# EAGLE design slo rev0.1 (EAGLE 9.1.1)
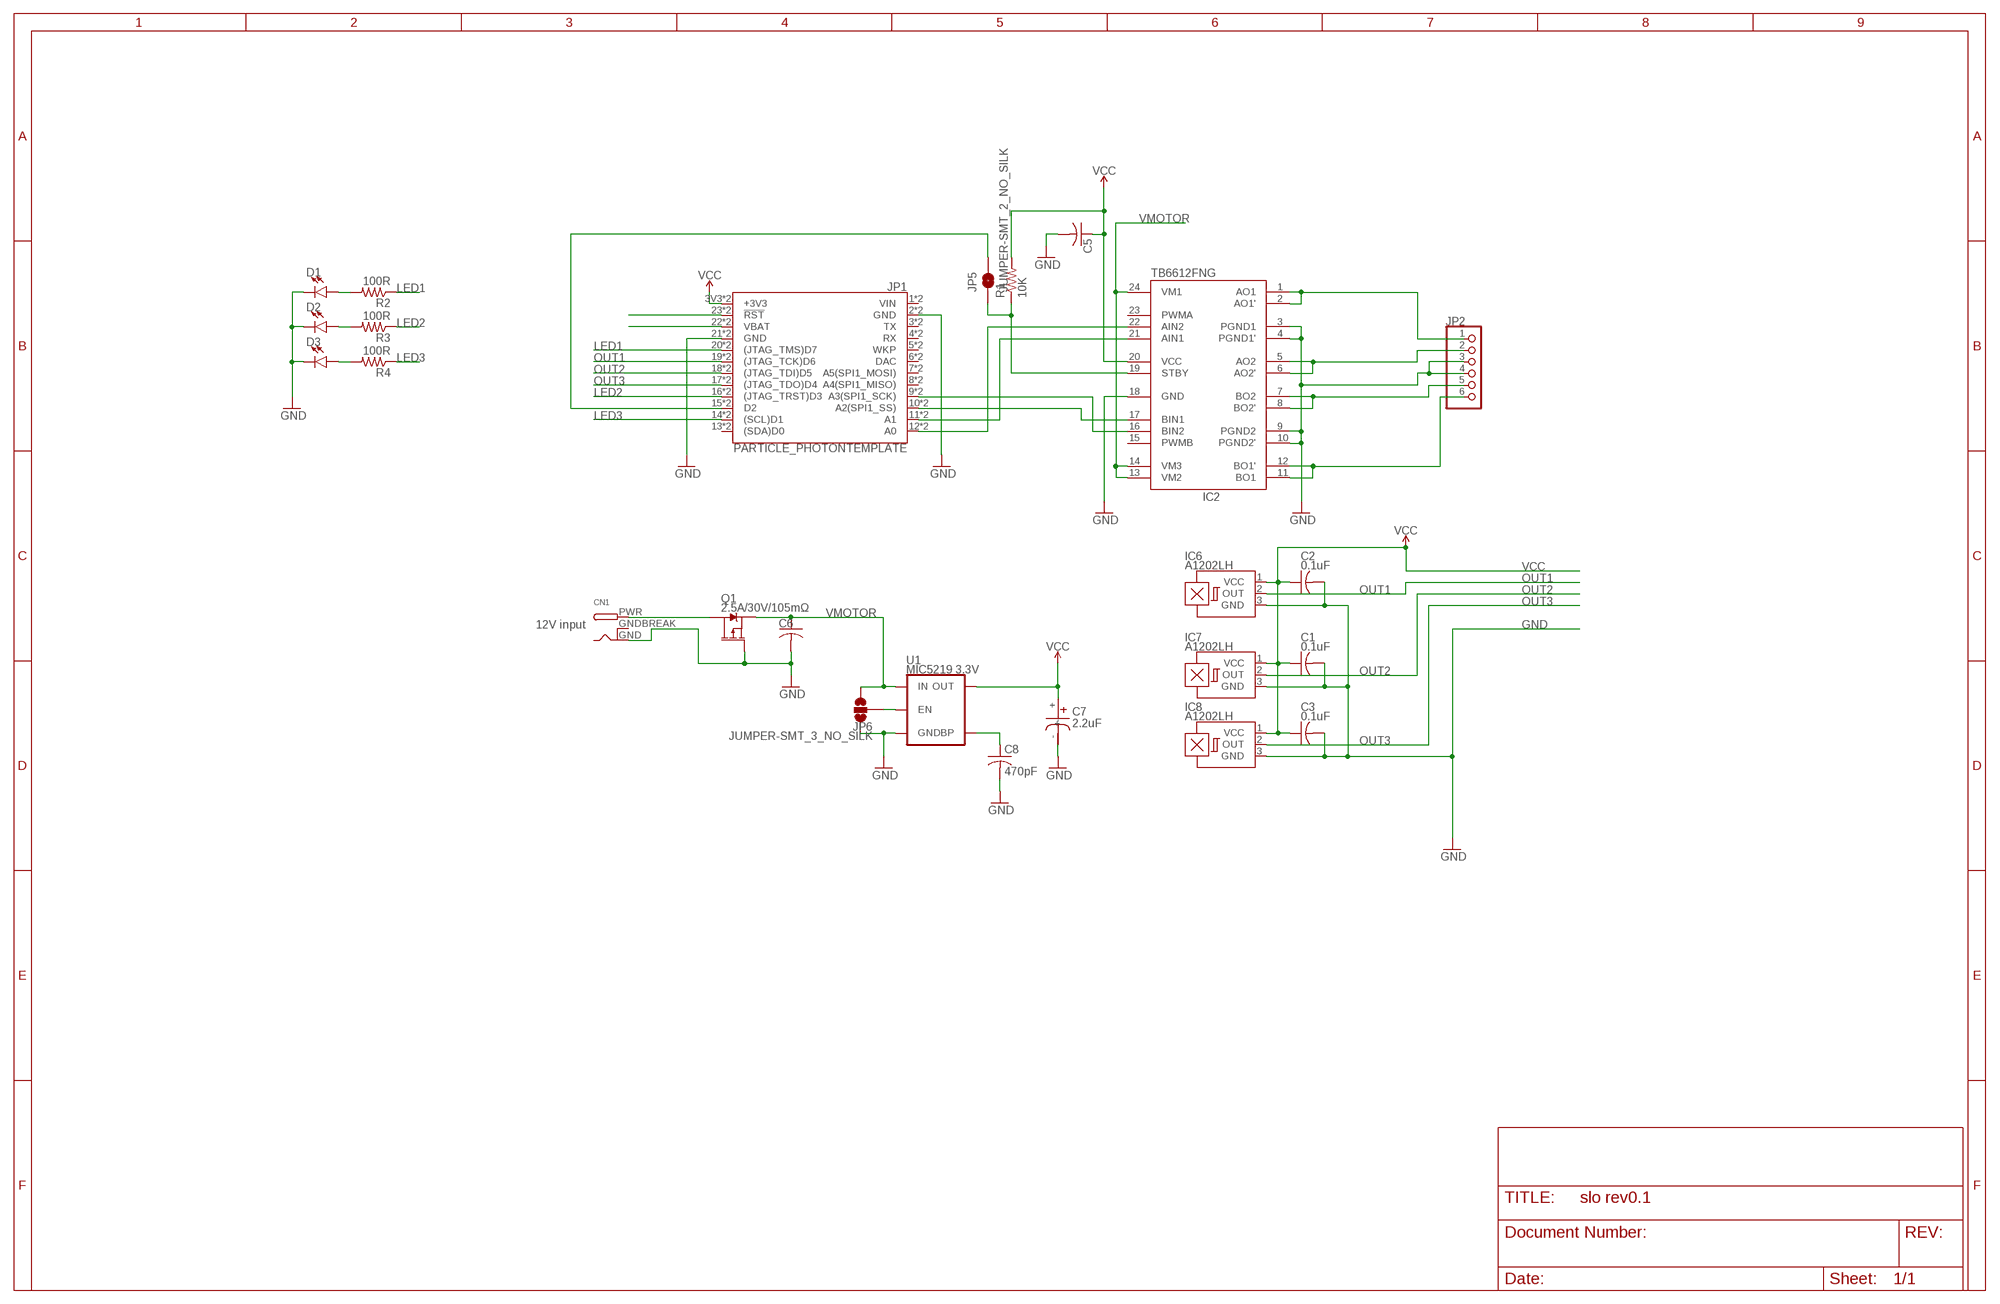
[diagram p0: schematic, sheet 1]

## Parts
C1  0.1uF  C-USC0603  [C0603]
C2  0.1uF  C-USC0603  [C0603]
C3  0.1uF  C-USC0603  [C0603]
C5  C-USC1206  [C1206]
C6  C-USC1206  [C1206]
C7  2.2uF  0603_TANTALUM_CAP  [0603_TANTALUM_CAPACITOR]
C8  470pF  C-USC0603  [C0603]
CN1  DCBARRELPTH  [DCJACK_2MM_PTH]
D1  LED-FKIT-1206  [FKIT-LED-1206]
D2  LED-FKIT-1206  [FKIT-LED-1206]
D3  LED-FKIT-1206  [FKIT-LED-1206]
IC2  TB6612FNG  [SSOP24]
IC6  A1202LH  [SOT23-W]
IC7  A1202LH  [SOT23-W]
IC8  A1202LH  [SOT23-W]
JP1  PARTICLE_PHOTONTEMPLATE  [PARTICLE_PHOTON_TEMPLATE]
JP2  PINHD-1X6-3.5MM  [1X06-3.5MM]
JP5  JUMPER-SMT_2_NO_SILK  [SMT-JUMPER_2_NO_SILK]
JP6  JUMPER-SMT_3_NO_SILK  [SMT-JUMPER_3_NO_SILK]
Q1  2.5A/30V/105mΩ  MOSFET_PCH-DMG2307L  [SOT23-3]
R1  10K  R-US_R1206  [R1206]
R2  100R  R-US_R1206  [R1206]
R3  100R  R-US_R1206  [R1206]
R4  100R  R-US_R1206  [R1206]
U1  MIC5219 3.3V  V_REG_MIC52193.3V  [SOT23-5]

## Nets
GND: C1.2 C2.2 C3.2 C5.2 C6.2 C7.- C8.2 CN1.GND D1.C D2.C D3.C IC2.3(PGND1) IC2.4(PGND1') IC2.9(PGND2) IC2.10(PGND2') IC2.18(GND) IC6.3(GND) IC7.3(GND) IC8.3(GND) JP1.2(GND) JP1.21(GND) JP1.GND@0(GND) JP1.GND@2(GND) JP2.3 JP2.4 JP6.1 Q1.1(G) U1.2(GND)
LED1: JP1.20((JTAG_TMS)D7) JP1.D7((JTAG_TMS)D7) R2.1
LED2: JP1.16((JTAG_TRST)D3) JP1.D3((JTAG_TRST)D3) R3.1
LED3: JP1.14((SCL)D1) JP1.D1((SCL)D1) R4.1
N$1: IC2.1(AO1) IC2.2(AO1') JP2.1
N$2: IC2.5(AO2) IC2.6(AO2') JP2.2
N$3: IC2.7(BO2) IC2.8(BO2') JP2.5
N$4: IC2.11(BO1) IC2.12(BO1') JP2.6
N$5: CN1.PWR Q1.3(D)
N$6: IC2.19(STBY) JP5.1 R1.1
N$7: D1.A R2.2
N$8: JP1.22(VBAT) JP1.VBAT
N$9: JP6.2 U1.3(EN)
N$10: JP1.23(!RST!) JP1.RST(!RST!)
N$11: IC2.22(AIN2) JP1.12(A0) JP1.A0
N$12: IC2.21(AIN1) JP1.11(A1) JP1.A1
N$13: IC2.17(BIN1) JP1.10(A2(SPI1_SS)) JP1.A2(A2(SPI1_SS))
N$14: IC2.16(BIN2) JP1.9(A3(SPI1_SCK)) JP1.A3(A3(SPI1_SCK))
N$15: JP1.15(D2) JP1.D2 JP5.2
N$16: D2.A R3.2
N$17: C8.1 U1.4(BP)
N$18: D3.A R4.2
OUT1: IC6.2(OUT) JP1.19((JTAG_TCK)D6) JP1.D6((JTAG_TCK)D6)
OUT2: IC7.2(OUT) JP1.18((JTAG_TDI)D5) JP1.D5((JTAG_TDI)D5)
OUT3: IC8.2(OUT) JP1.17((JTAG_TDO)D4) JP1.D4((JTAG_TDO)D4)
VCC: C1.1 C2.1 C3.1 C5.1 C7.+ IC2.20(VCC) IC6.1(VCC) IC7.1(VCC) IC8.1(VCC) JP1.3V3(+3V3) JP1.24(+3V3) R1.2 U1.5(OUT)
VMOTOR: C6.1 IC2.13(VM2) IC2.14(VM3) IC2.24(VM1) JP6.3 Q1.2(S) U1.1(IN)
Unconnected: IC2.15(PWMB) IC2.23(PWMA) JP1.3(TX) JP1.4(RX) JP1.5(WKP) JP1.6(DAC) JP1.7(A5(SPI1_MOSI)) JP1.8(A4(SPI1_MISO)) JP1.13((SDA)D0) JP1.A4(A4(SPI1_MISO)) JP1.A5(A5(SPI1_MOSI)) JP1.D0((SDA)D0) JP1.DAC JP1.RX JP1.TX JP1.WKP

## Notes on the sheet
- 12V input

## Power pins joined to a net without a drawn wire
GNDBREAK: CN1.GNDBREAK
VIN: JP1.1(VIN) JP1.VIN

## Library data of the parts
C1-C3 C5 C6 C8 = resistor:C-US: CAPACITOR, American symbol
C7 = clackboard_lib:0603_TANTALUM_CAP: https://www.digikey.com/product-detail/en/avx-corporation/TACL475K006XTA/478-7522-1-ND/3660369 0603 Tantalum capacitor CAP TANT 4.7UF 6.3V 10% 0603 // digikey pn 478-7522-1-ND
CN1 = adafruit:DCBARREL: 2.0mm DC Barrel Jack DCJACK_2MM_PTH - Through Hole Jack (4UConnector: 05537)
D1-D3 = SparkFun-LED:LED: LED (Generic) Standard schematic elements and footprints for 5mm, 3mm, 1206, and 0603 sized LEDs. Generic LEDs with no color specified.
IC2 = adafruit:TB6612FNG: TB6612FNG MOS dual H-bridge motor driver, 1.2A current 3.2A peak 3 or 5v logic and 3-15v motor
IC6-IC8 = allegro:A12*?: Hall-effect bipolar switch Source: http://www.allegromicro.com/en/Products/Part_Numbers/1202/1202.pdf; OC_FARNELL: unknown; OC_NEWARK: unknown
JP1 = SparkFun-Boards:PARTICLE_PHOTON: Particle Photon Footprint of the Particle Photon that is used as a basis for many Photon shields. SparkFun Products: Particle Photon <https://www.sparkfun.com/products/13764> SparkFun Photon ProtoShield <https://www.sparkfun.com/products/13598> SparkFun Photon micro OLED Shield <https://www.sparkfun.com/products/13628> SparkFun Photon IMU Shield <https://www.sparkfun.com/products/13629> SparkFun Photon Battery Shield <https://www.sparkfun.com/products/13626>
JP2 = adafruit:PINHD-1X6: PIN HEADER
JP5 = SparkFun-Jumpers:JUMPER-SMT_2_NO: Normally open jumper This jumper has two pads in close proximity to each other. Apply solder to close the connection. Round pads are easier to solder for beginners, but are a lot larger. SparkFun Product that uses the round pads: SparkFun EL Sequencer <https://www.sparkfun.com/products/12781>
JP6 = SparkFun-Jumpers:JUMPER-SMT_3_NO: Normally open jumper This jumper has three pads in close proximity to each other. Apply solder to close the connection(s).
Q1 = SparkFun-DiscreteSemi:MOSFET_PCH: P-channel MOSFETs Voltage controlled devices that allow control of high current outputs. SparkFun Products: SparkFun ESP32 Thing <https://www.sparkfun.com/products/13907> SparkFun ESP8266 Thing <https://www.sparkfun.com/products/13231>; PROD_ID: TRANS-11308
R1-R4 = resistor:R-US_: RESISTOR, American symbol
U1 = SparkFun-IC-Power:V_REG_MIC5219: V_REG MIC5219 Standard 3.3V and 5V 500mA LDO voltage regulator in SOT-23 layout. Micrel part MIC5219. BP (by-pass) pin is used to lower output noise with 470pF cap, may be left open.; PROD_ID: VREG-09872

## Board
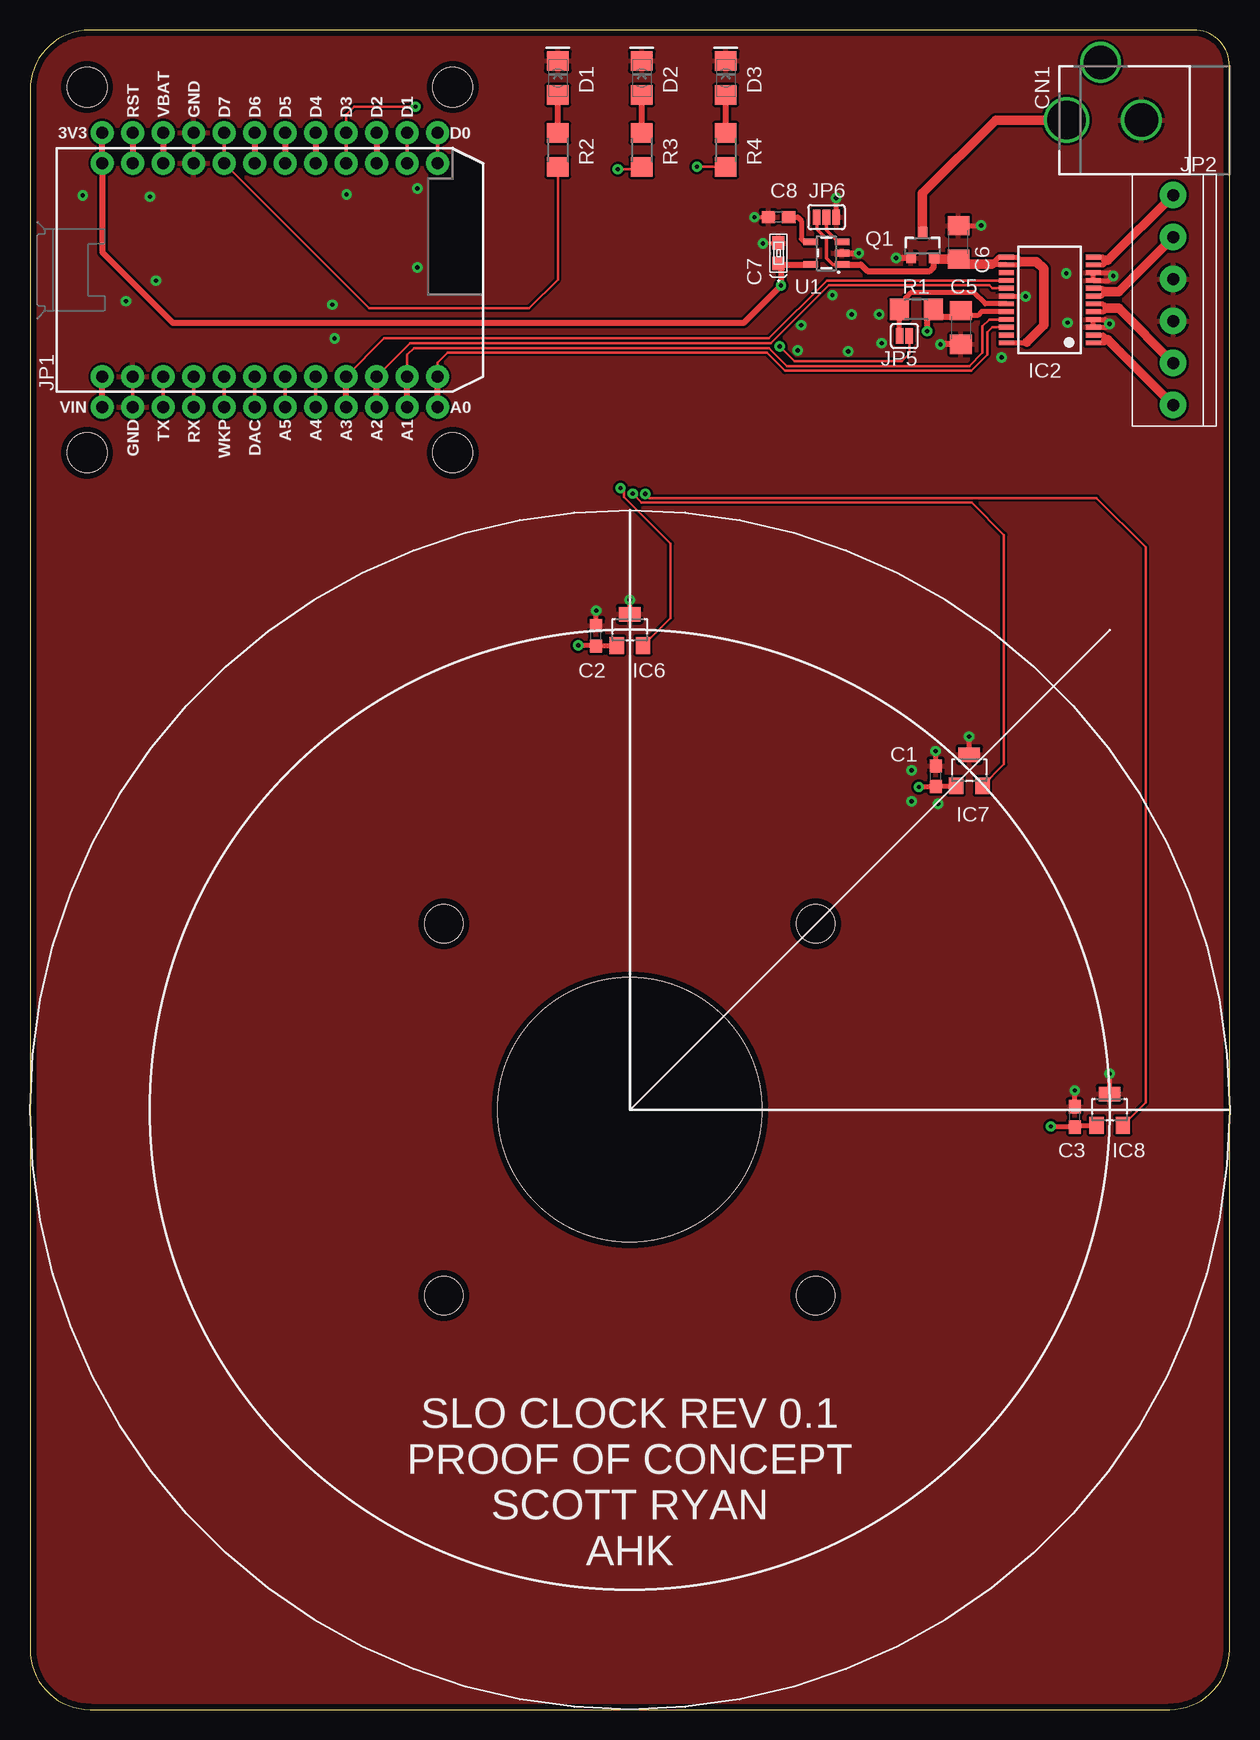
[diagram p1: board, top side]
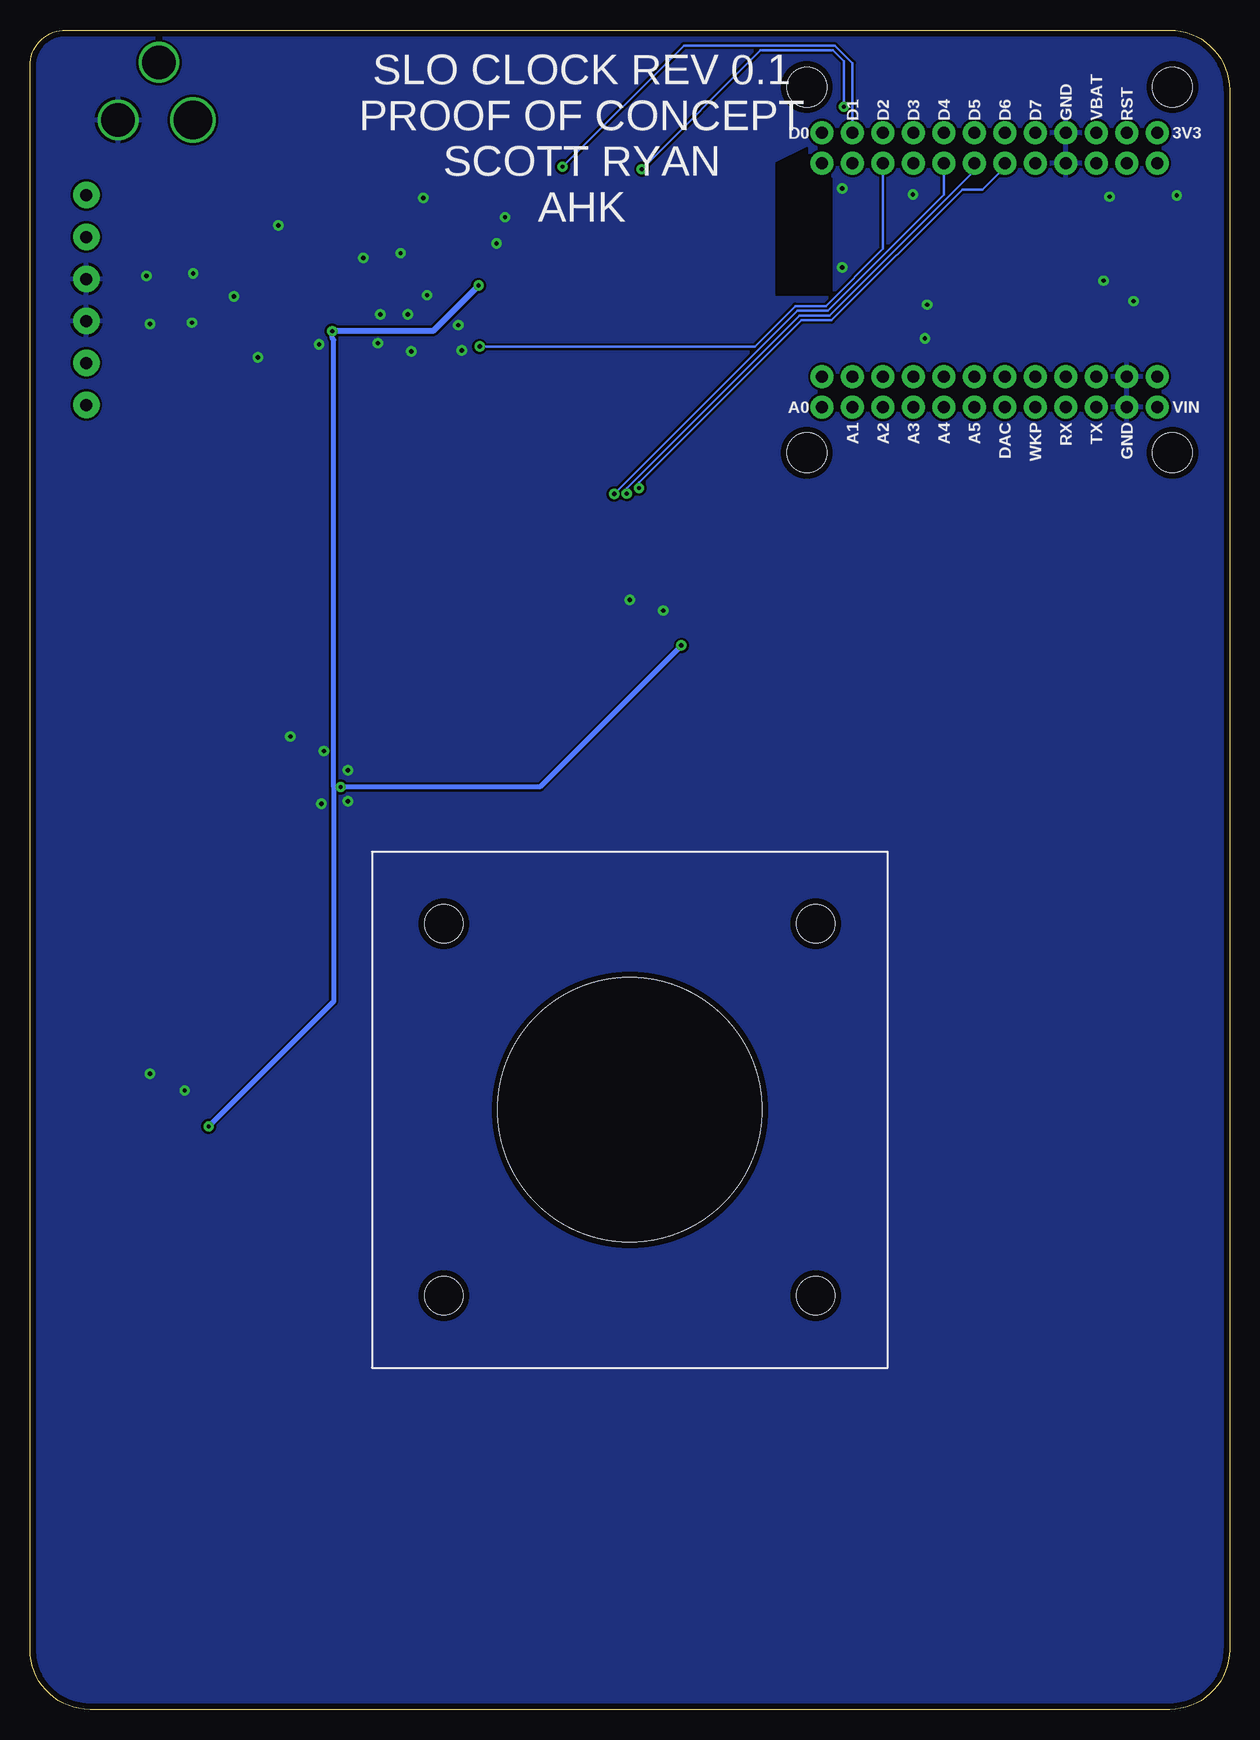
[diagram p2: board, bottom side, seen from below]

Size 100 x 140 mm. Coordinates in mm from the lower left corner, seen from the top.
Outline: 100,5 100,137 arc90 97,140 5,140 arc90 0,135 0,5 arc90 5,0 95,0 arc90 100,5
Copper layers (1*16): Top 0.035mm / dielectric 1.5mm / Bottom 0.035mm
Design rules "Class_5_0,20mm": minimum track width 0.2mm, minimum drill 0.3mm, track to track 0.2mm, track to pad 0.2mm, pad to pad 0.2mm, via to via 0.2mm, smd to smd 0.2mm, copper to edge 0.5mm, drill to drill 0.2mm, minimum pad ring 0.3mm, minimum via ring 0.25mm, stop-mask expansion 0.1mm, vias tented up to drill 0.6mm, thermal gap 0.25mm
Holes 3.17 mm at 34.5,65.5 65.5,65.5 65.5,34.5 34.5,34.5
Holes 22 mm at 50,50

### Footprints (pad centres in the part's own frame; a part is rotated, then mirrored left to right if it is on the bottom)
C0603 = smd 1.1 x 1: 1 -0.85,0; 2 0.85,0
C1206 = smd 1.6 x 1.8: 1 -1.4,0; 2 1.4,0
0603_TANTALUM_CAPACITOR = smd 1.1 x 1: + -0.85,0; - 0.85,0
DCJACK_2MM_PTH = drill 2.8: GND 0,7.35; GNDBREAK 4.8,10.75 | drill 3.2: PWR 0,13.6
FKIT-LED-1206 = smd 1.6 x 1.803: A -1.422,0; C 1.422,0
SSOP24 = smd 0.4 x 1.25: 1 -3.575,-3.625; 2 -2.925,-3.625; 3 -2.275,-3.625; 4 -1.625,-3.625; 5 -0.975,-3.625; 6 -0.325,-3.625; 7 0.325,-3.625; 8 0.975,-3.625; 9 1.625,-3.625; 10 2.275,-3.625; 11 2.925,-3.625; 12 3.575,-3.625; 13 3.575,3.625; 14 2.925,3.625; 15 2.275,3.625; 16 1.625,3.625; 17 0.975,3.625; 18 0.325,3.625; 19 -0.325,3.625; 20 -0.975,3.625; 21 -1.625,3.625; 22 -2.275,3.625; 23 -2.925,3.625; 24 -3.575,3.625
SOT23-W = smd 1.2 x 1.4: 1 -1.1,-1.3; 2 1.1,-1.3 | smd 1.8 x 1.2: 3 0,1.3
PARTICLE_PHOTON_TEMPLATE = drill 1.016 pad 1.905: 1 -8.89,13.97; 2 -8.89,11.43; 3 -8.89,8.89; 4 -8.89,6.35; 5 -8.89,3.81; 6 -8.89,1.27; 7 -8.89,-1.27; 8 -8.89,-3.81; 9 -8.89,-6.35; 10 -8.89,-8.89; 11 -8.89,-11.43; 12 -8.89,-13.97; 13 8.89,-13.97; 14 8.89,-11.43; 15 8.89,-8.89; 16 8.89,-6.35; 17 8.89,-3.81; 18 8.89,-1.27; 19 8.89,1.27; 20 8.89,3.81; 21 8.89,6.35; 22 8.89,8.89; 23 8.89,11.43; 24 8.89,13.97 | drill 1.016 pad 1.93: 3V3 11.43,13.97; A0 -11.43,-13.97; A1 -11.43,-11.43; A2 -11.43,-8.89; A3 -11.43,-6.35; A4 -11.43,-3.81; A5 -11.43,-1.27; D0 11.43,-13.97; D1 11.43,-11.43; D2 11.43,-8.89; D3 11.43,-6.35; D4 11.43,-3.81; D5 11.43,-1.27; D6 11.43,1.27; D7 11.43,3.81; DAC -11.43,1.27; GND@0 -11.43,11.43; GND@2 11.43,6.35; RST 11.43,11.43; RX -11.43,6.35; TX -11.43,8.89; VBAT 11.43,8.89; VIN -11.43,13.97; WKP -11.43,3.81 | hole 3.302: -15.24,15.24; 15.24,15.24; -15.24,-15.24; 15.24,-15.24
1X06-3.5MM = drill 1 pad 2.184: 1 -8.75,0; 2 -5.25,0; 3 -1.75,0; 4 1.75,0; 5 5.25,0; 6 8.75,0
SMT-JUMPER_2_NO_SILK = smd 0.635 x 1.27: 1 -0.406,0; 2 0.406,0
SMT-JUMPER_3_NO_SILK = smd 0.635 x 1.27: 1 -0.813,0; 2 0,0; 3 0.813,0
SOT23-3 = smd 0.8 x 0.9: 1 -0.95,-1; 2 0.95,-1; 3 0,1.1
R1206 = smd 1.6 x 1.803: 1 -1.422,0; 2 1.422,0
SOT23-5 = smd 0.55 x 1.2: 1 -0.95,-1.3; 2 0,-1.3; 3 0.95,-1.3; 4 0.95,1.3; 5 -0.95,1.3

### Placement (x,y rotation side)
C1  75.5,77.8 90 top
C2  47.2,89.5 90 top
C3  87.1,49.4 90 top
C5  77.6,115.2 270 top
C6  77.4,122.3 90 top
C7  62.4,121.4 90 top
C8  62.4,124.4 180 top
CN1  100,132.5 90 top
D1  44,136 90 top
D2  51,136 90 top
D3  58,136 90 top
IC2  85,117.5 90 top
IC6  50,90 0 top
IC7  78.3,78.3 0 top
IC8  90,50 0 top
JP1  20,120 90 top
JP2  95.3,117.5 90 top
JP5  72.9,114.5 0 top
JP6  66.4,124.4 180 top
Q1  74.4,122 0 top
R1  73.9,116.7 0 top
R2  44,130 90 top
R3  51,130 90 top
R4  58,130 90 top
U1  66.4,121.4 90 top

### Tracks (layer width: path | path; a pad name or v marks a point on that pad's centre or on a via)
GND  (via drill 0.35)
  Top 0.3: C7.- 61.15,122.25 v61.1,122.2 | C8.2 v60.4,124.4
  Top 0.4: IC2.18 82.97,117.83 v83,117.8 | C6.2 v79.3,123.7 | JP6.1 67.21,125.99 v67.2,126 | C2.2 v47.2,91.6 | IC6.3 v50,92.5 | C1.2 v75.5,79.9 | IC7.3 v78.3,81.1 | C3.2 v87.1,51.6 | IC8.3 v90,53 | IC2.9 IC2.10 90.03,119.78 v90.3,119.5 89.92,119.12 IC2.9 | IC2.4 89.62,115.88 v90,115.5 89.72,115.22 IC2.3 IC2.4
  Top 0.5: C5.2 v75.9,113.8 | Q1.1 v72.2,121 | U1.2 v69.1,121.4
  other vias: 71,113.9 64.3,115.4 64,113.3 68.2,113.2 68.5,116.3 70.8,116.3 66.9,117.9 86.4,119.7 86.5,115.6 81,112.7 73.5,78.3 73.5,75.7 75.7,75.5 25.4,114.3 8,117.4 32.3,120.2 32.3,126.8 26.4,126.3 10,126.1 4.4,126.2 25.2,117.1 10.5,119.1
  pour Bottom: 0,0 100,0 100,140 0,140
  pour Top: 0,0 100,0 100,140 0,140
LED1
  Top 0.2: R2.1 44,119.2 41.6,116.8 28.28,116.8 JP1.20 JP1.D7
LED2  (via drill 0.35)
  Top 0.2: R3.1 50.82,128.4 v49,128.4 | v32.16,133.6 27,133.6 26.35,132.95 26.35,131.6 JP1.D3 JP1.16
  Bottom 0.2: v49,128.4 39.1,138.3 33.07,138.3 32.16,137.39 v32.16,133.6
LED3  (via drill 0.35)
  Top 0.2: v55.6,128.6 57.98,128.6 R4.1 | JP1.14 JP1.D1
  Bottom 0.2: JP1.D1 31.43,137.23 32.9,138.7 45.5,138.7 v55.6,128.6
N$1
  Top 0.4: IC2.1 89.58,113.92 89.85,114.2 89.47,114.58 IC2.2
  Top 0.8: JP2.1 89.85,114.2 89.7,114.2
N$2
  Top 0.4: IC2.5 89.53,116.53 89.8,116.8 89.42,117.17 IC2.6
  Top 0.8: JP2.2 90.75,116.8 89.8,116.8
N$3
  Top 0.4: IC2.7 89.33,117.83 89.7,118.2 89.42,118.47 IC2.8
  Top 0.8: JP2.5 90.75,118.2 89.7,118.2
N$4
  Top 0.4: IC2.11 89.47,120.42 89.85,120.8 | IC2.12 89.42,121.08 89.7,120.8
  Top 0.8: JP2.6 89.85,120.8 89.7,120.8
N$5
  Top 0.8: Q1.3 74.4,126.4 80.5,132.5 CN1.PWR
N$6
  Top 0.4: JP5.1 72.49,116.68 | 72.49,116.68 R1.1 | IC2.19 79.62,117.17 78.7,118.1 73.4,118.1 73,117.7 73,117.2 72.49,116.69 72.49,116.68
N$7
  Top 0.5: R2.2 D1.A
N$8
  Top 0.5: JP1.VBAT JP1.22
N$9
  Top 0.3: U1.3 67.35,122.35 66.4,123.3 JP6.2
N$10
  Top 0.5: JP1.RST JP1.23
N$11
  Top 0.2: IC2.22 80.22,115.22 79.8,114.8 79.8,112.93 78.47,111.6 62.93,111.6 61.43,113.1 34.8,113.1 33.97,112.27 JP1.12
  Top 0.5: JP1.A0 JP1.12
N$12
  Top 0.2: JP1.11 31.43,111.3 31.43,112.93 32,113.5 61.6,113.5 63.1,112 78.3,112 79.4,113.1 79.4,115.3 79.97,115.88 IC2.21
  Top 0.5: JP1.A1 31.43,111.3
N$13
  Top 0.2: IC2.17 80.22,118.47 79.97,118.72 66.59,118.72 61.77,113.9 31.68,113.9 JP1.10
  Top 0.5: JP1.A2 JP1.10
N$14
  Top 0.2: IC2.16 66.42,119.12 61.6,114.3 29.54,114.3 JP1.9
  Top 0.5: JP1.A3 JP1.9
N$15  (via drill 0.35)
  Top 0.2: JP5.2 73.31,113.01 72.7,112.4 63.73,112.4 v62.51,113.62
  Top 0.5: JP1.D2 JP1.15
  Bottom 0.2: v62.51,113.62 39.57,113.62 36.19,117 33.67,117 28.89,121.78 JP1.15
N$16
  Top 0.5: R3.2 D2.A
N$17
  Top 0.4: C8.1 64,124.4 64.3,124.1 64.3,122.6 64.6,122.3 64.65,122.35 U1.4
N$18
  Top 0.5: R4.2 D3.A
OUT1  (via drill 0.35)
  Top 0.2: v49.23,101.81 49.52,101.51 49.52,101.05 53.4,97.17 53.4,91 IC6.2
  Top 0.5: JP1.D6 JP1.19
  Bottom 0.2: v49.23,101.81 49.23,102.27 35.69,115.8 33.17,115.8 22.27,126.7 20.6,126.7 18.73,128.57 JP1.19
OUT2  (via drill 0.35)
  Top 0.2: IC7.2 81.2,78.8 81.2,97.9 78.5,100.6 51,100.6 v50.25,101.35
  Top 0.5: JP1.D5 JP1.18
  Bottom 0.2: v50.25,101.35 50.25,101.81 35.86,116.2 33.33,116.2 21.27,128.26 JP1.18
OUT3  (via drill 0.35)
  Top 0.2: v51.3,101.33 51.62,101 88.9,101 93,96.9 93,50.6 IC8.2
  Top 0.5: JP1.D4 JP1.17
  Bottom 0.2: v51.3,101.33 36.02,116.6 33.5,116.6 23.81,126.29 JP1.17
VCC  (via drill 0.35)
  Top 0.4: IC2.20 79.33,116.53 79,116.2 78,116.2 C5.1 | IC7.1 75.55,77 C1.1 74.15,76.95 v74.1,76.9 | C3.1 87.12,48.58 | 87.12,48.58 87.25,48.7 IC8.1 | IC6.1 47.25,88.7 C2.1 47.15,88.7 v45.7,88.7 | v85.1,48.6 87.1,48.6 87.12,48.58
  Top 0.5: U1.5 62.5,120.45 C7.+ 62.6,120.35 v62.6,118.7 59.5,115.6 11.9,115.6 6.03,121.47 JP1.24 JP1.3V3 | v74.8,114.9 74.8,116.4 75.02,116.4 R1.2 75.92,116.1 77.1,116.1 C5.1
  Top 0.8: 75.42,116.6 R1.2
  Bottom 0.4: 74.67,76.9 74.67,59.02 v85.1,48.6 | 74.67,76.9 v74.1,76.9 57.5,76.9 v45.7,88.7 | v74.8,114.9 74.8,114.3 74.67,114.17 74.67,76.9
  Bottom 0.5: v62.6,118.7 66.4,114.9 v74.8,114.9
VIN
  Top 0.5: JP1.VIN JP1.1
VMOTOR
  Top 0.3: JP6.3 65.59,123.41 66.4,122.59 66.4,121 66.95,120.45 U1.1
  Top 0.4: IC2.24 83.03,113.92 83.1,114 | IC2.14 80.28,120.42 80.2,120.5 80.78,121.08 IC2.13 82.33,121.08 82.7,120.7 82.42,120.42 IC2.14
  Top 0.5: U1.1 69.25,120.45 69.8,119.9 75,119.9 75.35,120.25 Q1.2
  Top 0.8: 80.2,120.5 77.8,120.5 C6.1 75.45,120.9 Q1.2 | 83.1,114 84.5,115.4 84.5,120.1 83.9,120.7 82.7,120.7

### Text on the board
tPlace: SLO CLOCK REV 0.1 / PROOF OF CONCEPT / SCOTT RYAN / AHK
bPlace: SLO CLOCK REV 0.1 / PROOF OF CONCEPT / SCOTT RYAN / AHK